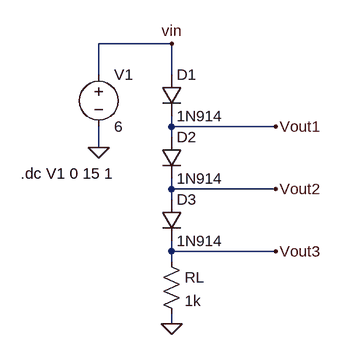
[diagram p0: schematic smallsignal_voltageDropper.asc]
smallsignal_voltageDropper.asc, the LTspice schematic file:
Version 4
SHEET 1 880 680
WIRE 176 32 64 32
WIRE 64 80 64 32
WIRE 176 80 176 32
WIRE 176 160 176 144
WIRE 336 160 176 160
WIRE 176 176 176 160
WIRE 64 192 64 160
WIRE 176 256 176 240
WIRE 336 256 176 256
WIRE 176 272 176 256
WIRE 176 352 176 336
WIRE 336 352 176 352
WIRE 176 368 176 352
WIRE 176 464 176 448
FLAG 336 160 Vout1
FLAG 336 256 Vout2
FLAG 176 464 0
FLAG 64 192 0
FLAG 176 32 vin
FLAG 336 352 Vout3
SYMBOL diode 160 80 R0
SYMATTR InstName D1
SYMATTR Value 1N914
SYMBOL diode 160 176 R0
SYMATTR InstName D2
SYMATTR Value 1N914
SYMBOL diode 160 272 R0
SYMATTR InstName D3
SYMATTR Value 1N914
SYMBOL res 160 352 R0
SYMATTR InstName RL
SYMATTR Value 1k
SYMBOL voltage 64 64 R0
WINDOW 123 0 0 Left 0
WINDOW 39 0 0 Left 0
SYMATTR InstName V1
SYMATTR Value 6
TEXT -56 232 Left 2 !.dc V1 0 15 1

The netlist it stands for:
* smallsignal_voltageDropper.asc
D1 vin Vout1 1N914
D2 Vout1 Vout2 1N914
D3 Vout2 Vout3 1N914
RL Vout3 0 1k
V1 vin 0 6
.model D D
.lib standard.dio
.dc V1 0 15 1
.backanno
.end